# Altium project OrangeCrab.PrjPcb (part 2 of 2)
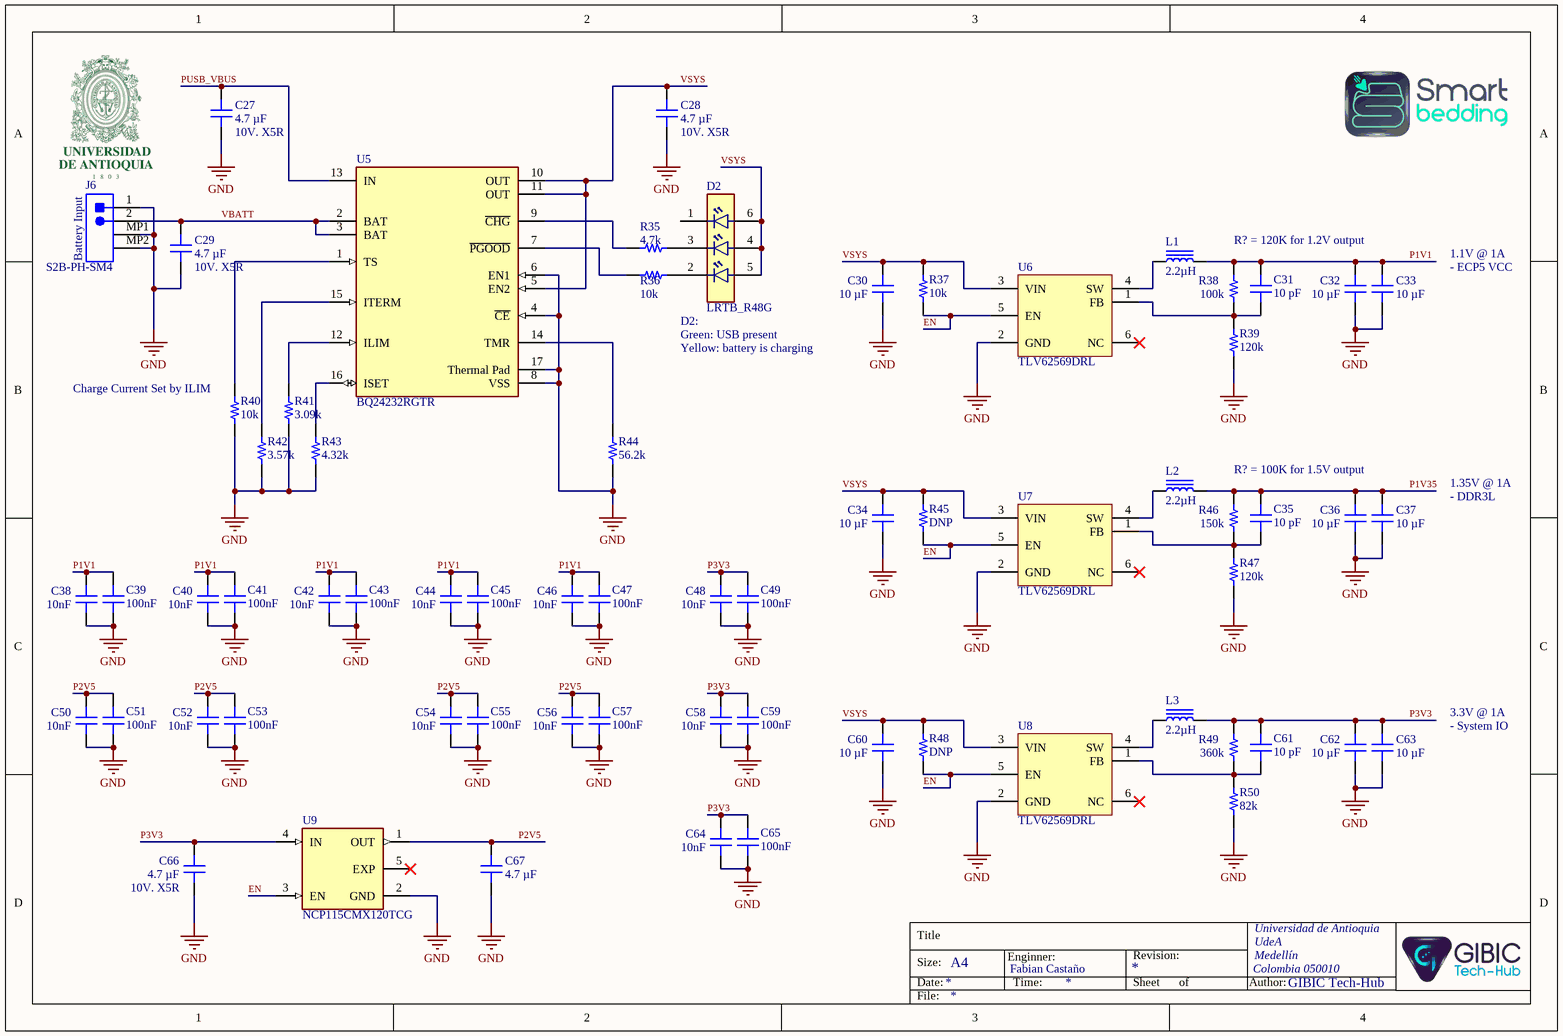
[diagram p6: 05-Power_Sources.SchDoc]

## Nets that join several sheets
GND: 01-FPGA_Sources (127 pins), 02-FPGA_Banks (11 pins), 03-DRAM_Memory (38 pins), 04-External_Connectors (29 pins), 05-Power_Sources (57 pins)
ADC_CTRL0: 02-FPGA_Banks (U1.G1), 04-External_Connectors (R22.1)
ADC_CTRL1: 02-FPGA_Banks (U1.F1), 04-External_Connectors (U4.15)
ADC_MUX0: 02-FPGA_Banks (U1.F4), 04-External_Connectors (U4.10)
ADC_MUX1: 02-FPGA_Banks (U1.F3), 04-External_Connectors (U4.11)
ADC_MUX2: 02-FPGA_Banks (U1.F2), 04-External_Connectors (U4.14)
ADC_MUX3: 02-FPGA_Banks (U1.H1), 04-External_Connectors (U4.13)
ADC_SENSE_HI: 02-FPGA_Banks (U1.H3), 04-External_Connectors (R17.2 R21.2)
ADC_SENSE_LO: 02-FPGA_Banks (U1.G3), 04-External_Connectors (C22.2 R22.2)
ECP5_VREF: 02-FPGA_Banks (9 pins), 03-DRAM_Memory (6 pins)
EN: 04-External_Connectors (J2.2), 05-Power_Sources (7 pins)
FPGA_RESET: 02-FPGA_Banks (R3.2 U1.T15 U1.V17), 04-External_Connectors (J4.1)
IO_0: 02-FPGA_Banks (U1.N17), 04-External_Connectors (J4.14)
IO_1: 02-FPGA_Banks (U1.M18), 04-External_Connectors (J4.15)
IO_5: 02-FPGA_Banks (U1.B10), 04-External_Connectors (J2.10)
IO_6: 02-FPGA_Banks (U1.B9), 04-External_Connectors (J2.9)
IO_9: 02-FPGA_Banks (U1.C8), 04-External_Connectors (J2.8)
IO_10: 02-FPGA_Banks (U1.B8), 04-External_Connectors (J2.7)
IO_11: 02-FPGA_Banks (U1.A8), 04-External_Connectors (J2.6)
IO_12: 02-FPGA_Banks (U1.H2), 04-External_Connectors (J2.5)
IO_13: 02-FPGA_Banks (U1.J2), 04-External_Connectors (J2.4)
IO_A0: 02-FPGA_Banks (U1.L4), 04-External_Connectors (R18.1)
IO_A1: 02-FPGA_Banks (U1.N3), 04-External_Connectors (R23.1)
IO_A2: 02-FPGA_Banks (U1.N4), 04-External_Connectors (R19.1)
IO_A3: 02-FPGA_Banks (U1.H4), 04-External_Connectors (R24.1)
IO_A4: 02-FPGA_Banks (U1.G4), 04-External_Connectors (R20.1)
IO_A5: 02-FPGA_Banks (U1.T17), 04-External_Connectors (R25.1)
IO_MISO: 02-FPGA_Banks (U1.N15), 04-External_Connectors (J4.13)
IO_MOSI: 02-FPGA_Banks (U1.N16), 04-External_Connectors (J4.12)
IO_SCK: 02-FPGA_Banks (U1.R17), 04-External_Connectors (J4.11)
IO_SCL: 02-FPGA_Banks (U1.C9), 04-External_Connectors (J2.11)
IO_SDA: 02-FPGA_Banks (U1.C10), 04-External_Connectors (J2.12)
JTAG_TCK: 01-FPGA_Sources (J1.9), 02-FPGA_Banks (R4.1 U1.U13)
JTAG_TDI: 01-FPGA_Sources (J1.7), 02-FPGA_Banks (U1.T13)
JTAG_TDO: 01-FPGA_Sources (J1.8), 02-FPGA_Banks (U1.V14)
JTAG_TMS: 01-FPGA_Sources (J1.10), 02-FPGA_Banks (U1.V13)
LED_B: 02-FPGA_Banks (U1.J3), 04-External_Connectors (R29.2)
LED_G: 02-FPGA_Banks (U1.M3), 04-External_Connectors (R27.2)
LED_R: 02-FPGA_Banks (U1.K4), 04-External_Connectors (R26.2)
P1V1: 04-External_Connectors (U4.17), 05-Power_Sources (15 pins)
P1V35: 02-FPGA_Banks (6 pins), 03-DRAM_Memory (FB1.1 FB2.1 R5.1), 04-External_Connectors (R28.2 U4.19), 05-Power_Sources (5 pins)
P2V5: 04-External_Connectors (U4.18), 05-Power_Sources (10 pins)
P3V3: 02-FPGA_Banks (R2.1 R3.1 U1.T14), 04-External_Connectors (10 pins), 05-Power_Sources (13 pins)
PUSB_VBUS: 04-External_Connectors (5 pins), 05-Power_Sources (C27.1 U5.13)
QSPI_D2: 01-FPGA_Sources (U2.3), 02-FPGA_Banks (U1.R18)
QSPI_D3: 01-FPGA_Sources (U2.7), 02-FPGA_Banks (U1.N18)
RAM_A0: 02-FPGA_Banks (U1.C4), 03-DRAM_Memory (U3.N3)
RAM_A1: 02-FPGA_Banks (U1.D2), 03-DRAM_Memory (U3.P7)
RAM_A2: 02-FPGA_Banks (U1.D3), 03-DRAM_Memory (U3.P3)
RAM_A3: 02-FPGA_Banks (U1.A3), 03-DRAM_Memory (U3.N2)
RAM_A4: 02-FPGA_Banks (U1.A4), 03-DRAM_Memory (U3.P8)
RAM_A5: 02-FPGA_Banks (U1.D4), 03-DRAM_Memory (U3.P2)
RAM_A6: 02-FPGA_Banks (U1.C3), 03-DRAM_Memory (U3.R8)
RAM_A7: 02-FPGA_Banks (U1.B2), 03-DRAM_Memory (U3.R2)
RAM_A8: 02-FPGA_Banks (U1.B1), 03-DRAM_Memory (U3.T8)
RAM_A9: 02-FPGA_Banks (U1.D1), 03-DRAM_Memory (U3.R3)
RAM_A10: 02-FPGA_Banks (U1.A7), 03-DRAM_Memory (U3.L7)
RAM_A11: 02-FPGA_Banks (U1.C2), 03-DRAM_Memory (U3.R7)
RAM_A12: 02-FPGA_Banks (U1.B6), 03-DRAM_Memory (U3.N7)
RAM_A13: 02-FPGA_Banks (U1.C1), 03-DRAM_Memory (U3.T3)
RAM_A14: 02-FPGA_Banks (U1.A2), 03-DRAM_Memory (U3.T7)
RAM_A15: 02-FPGA_Banks (U1.C7), 03-DRAM_Memory (U3.M7)
RAM_BA0: 02-FPGA_Banks (U1.D6), 03-DRAM_Memory (U3.M2)
RAM_BA1: 02-FPGA_Banks (U1.B7), 03-DRAM_Memory (U3.N8)
RAM_BA2: 02-FPGA_Banks (U1.A6), 03-DRAM_Memory (U3.M3)
RAM_CAS#: 02-FPGA_Banks (U1.D13), 03-DRAM_Memory (U3.K3)
RAM_CK_N: 02-FPGA_Banks (U1.K18), 03-DRAM_Memory (R8.2 U3.K7)
RAM_CK_P: 02-FPGA_Banks (U1.J18), 03-DRAM_Memory (R7.2 U3.J7)
RAM_CKE: 02-FPGA_Banks (U1.D18), 03-DRAM_Memory (U3.K9)
RAM_CS#: 02-FPGA_Banks (U1.A12), 03-DRAM_Memory (U3.L2)
RAM_D0: 02-FPGA_Banks (U1.C17), 03-DRAM_Memory (U3.E3)
RAM_D1: 02-FPGA_Banks (U1.D15), 03-DRAM_Memory (U3.F7)
RAM_D2: 02-FPGA_Banks (U1.B17), 03-DRAM_Memory (U3.F2)
RAM_D3: 02-FPGA_Banks (U1.C16), 03-DRAM_Memory (U3.F8)
RAM_D4: 02-FPGA_Banks (U1.A15), 03-DRAM_Memory (U3.H3)
RAM_D5: 02-FPGA_Banks (U1.B13), 03-DRAM_Memory (U3.H8)
RAM_D6: 02-FPGA_Banks (U1.A17), 03-DRAM_Memory (U3.G2)
RAM_D7: 02-FPGA_Banks (U1.A13), 03-DRAM_Memory (U3.H7)
RAM_D8: 02-FPGA_Banks (U1.F17), 03-DRAM_Memory (U3.D7)
RAM_D9: 02-FPGA_Banks (U1.F16), 03-DRAM_Memory (U3.C3)
RAM_D10: 02-FPGA_Banks (U1.G15), 03-DRAM_Memory (U3.C8)
RAM_D11: 02-FPGA_Banks (U1.F15), 03-DRAM_Memory (U3.C2)
RAM_D12: 02-FPGA_Banks (U1.J16), 03-DRAM_Memory (U3.A7)
RAM_D13: 02-FPGA_Banks (U1.C18), 03-DRAM_Memory (U3.A2)
RAM_D14: 02-FPGA_Banks (U1.H16), 03-DRAM_Memory (U3.B8)
RAM_D15: 02-FPGA_Banks (U1.F18), 03-DRAM_Memory (U3.A3)
RAM_LDM: 02-FPGA_Banks (U1.G16), 03-DRAM_Memory (U3.E7)
RAM_LDQS_N: 02-FPGA_Banks (U1.H17), 03-DRAM_Memory (U3.B7)
RAM_LDQS_P: 02-FPGA_Banks (U1.G18), 03-DRAM_Memory (U3.C7)
RAM_ODT: 02-FPGA_Banks (U1.C13), 03-DRAM_Memory (U3.K1)
RAM_RAS#: 02-FPGA_Banks (U1.C12), 03-DRAM_Memory (U3.J3)
RAM_RESET#: 02-FPGA_Banks (U1.L18), 03-DRAM_Memory (U3.T2)
RAM_UDM: 02-FPGA_Banks (U1.D16), 03-DRAM_Memory (U3.D3)
RAM_UDQS_N: 02-FPGA_Banks (U1.A16), 03-DRAM_Memory (U3.G3)
RAM_UDQS_P: 02-FPGA_Banks (U1.B15), 03-DRAM_Memory (U3.F3)
RAM_WE#: 02-FPGA_Banks (U1.B12), 03-DRAM_Memory (U3.L3)
REF_CLK: 01-FPGA_Sources (Y1.3), 02-FPGA_Banks (U1.A9)
SD0_CD: 02-FPGA_Banks (U1.L1), 04-External_Connectors (J5.9 R34.1)
SD0_CLK: 02-FPGA_Banks (U1.K1), 04-External_Connectors (J5.5)
SD0_CMD: 02-FPGA_Banks (U1.K2), 04-External_Connectors (J5.3 R32.1)
SD0_DAT0: 02-FPGA_Banks (U1.J1), 04-External_Connectors (J5.7 R31.1)
SD0_DAT1: 02-FPGA_Banks (U1.K3), 04-External_Connectors (J5.8 R30.1)
SD0_DAT2: 02-FPGA_Banks (U1.L3), 04-External_Connectors (J5.1 R33.1)
SD0_DAT3: 02-FPGA_Banks (U1.M1), 04-External_Connectors (J5.2)
SPI_CONFIG_MISO: 01-FPGA_Sources (U2.2), 02-FPGA_Banks (U1.T18)
SPI_CONFIG_MOSI: 01-FPGA_Sources (U2.5), 02-FPGA_Banks (U1.U18)
SPI_CONFIG_SCK: 01-FPGA_Sources (U2.6), 02-FPGA_Banks (R2.2 U1.U16)
SPI_CONFIG_SS: 01-FPGA_Sources (R1.2 U2.1), 02-FPGA_Banks (U1.U17)
USB_D+: 02-FPGA_Banks (U1.N1), 04-External_Connectors (R11.2 R12.1)
USB_D-: 02-FPGA_Banks (U1.M2), 04-External_Connectors (R14.1)
USB_PULLUP: 02-FPGA_Banks (U1.N2), 04-External_Connectors (R11.1)
USER_BUTTON: 02-FPGA_Banks (U1.J17), 04-External_Connectors (C26.2 R28.1 SW1.3 SW1.4)
VBATT: 04-External_Connectors (J2.1 R10.2), 05-Power_Sources (C29.1 J6.2 U5.2 U5.3)